# EAGLE design panelmutlimec1lcd (EAGLE 5.06)
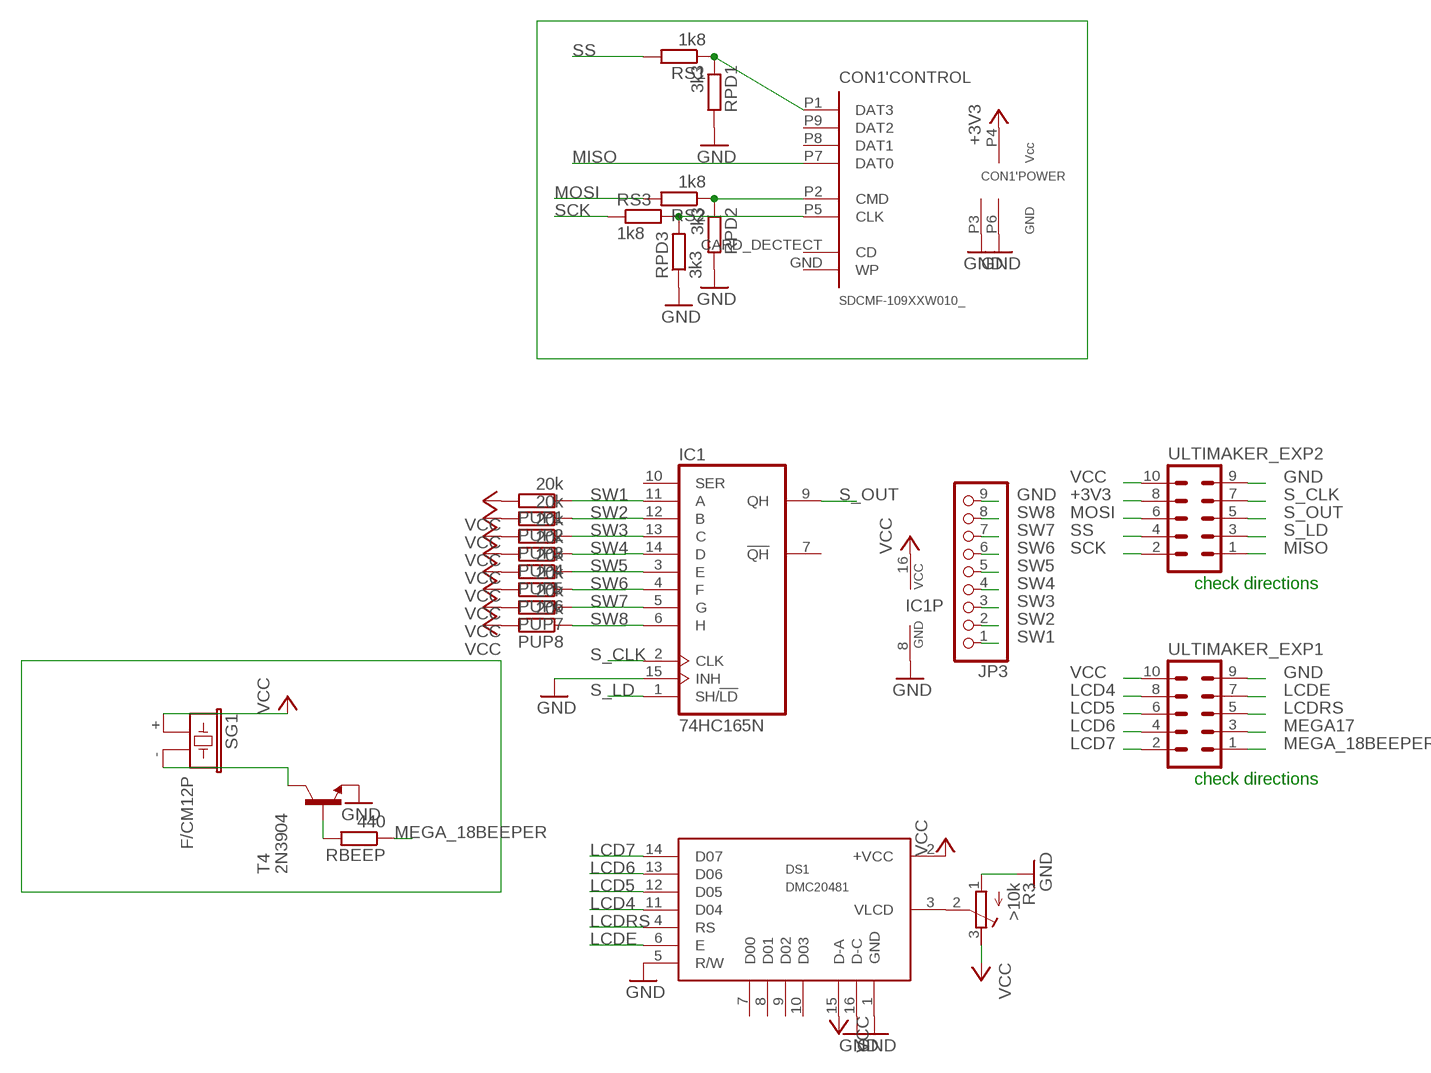
[diagram p0: schematic, sheet 1]

## Parts
CON1  SDCMF-109XXW010_  [HRS163]
DS1  DMC20481  [DM20481]
IC1  74HC165N  [DIL16]
JP3  PINHD-1X9  [1X09]
PUP1  20k  R-EU_R0805  [R0805]
PUP2  20k  R-EU_R0805  [R0805]
PUP3  20k  R-EU_R0805  [R0805]
PUP4  20k  R-EU_R0805  [R0805]
PUP5  20k  R-EU_R0805  [R0805]
PUP6  20k  R-EU_R0805  [R0805]
PUP7  20k  R-EU_R0805  [R0805]
PUP8  20k  R-EU_R0805  [R0805]
R3  >10k  R-TRIMM5X  [RTRIM5X]
RBEEP  440  R-EU_0207/10  [0207/10]
RPD1  3k3  R-EU_0207/12  [0207/12]
RPD2  3k3  R-EU_0207/12  [0207/12]
RPD3  3k3  R-EU_0207/12  [0207/12]
RS1  1k8  R-EU_0207/10  [0207/10]
RS2  1k8  R-EU_0207/10  [0207/10]
RS3  1k8  R-EU_0207/10  [0207/10]
SG1  F/CM12P  [F/CM12P]
T4  2N3904  [TO92]
ULTIMAKER_EXP1  ML10L  [ML10L]
ULTIMAKER_EXP2  ML10L  [ML10L]

## Nets
+3V3: CON1.P4('POWER:VCC) ULTIMAKER_EXP2.8
GND: CON1.P3('POWER:GND) CON1.P6('POWER:GND) DS1.1(GND) DS1.5(R/W) DS1.16(D-C) IC1.8(GND) IC1.15(INH) JP3.9 R3.1(E) RPD1.2 RPD2.2 RPD3.1 T4.3(E) ULTIMAKER_EXP1.9 ULTIMAKER_EXP2.9
LCD4: DS1.11(D04) ULTIMAKER_EXP1.8
LCD5: DS1.12(D05) ULTIMAKER_EXP1.6
LCD6: DS1.13(D06) ULTIMAKER_EXP1.4
LCD7: DS1.14(D07) ULTIMAKER_EXP1.2
LCDE: DS1.6(E) ULTIMAKER_EXP1.7
LCDRS: DS1.4(RS) ULTIMAKER_EXP1.5
MEGA17: ULTIMAKER_EXP1.3
MEGA_18BEEPER: RBEEP.1 ULTIMAKER_EXP1.1
MISO: CON1.P7('CONTROL:DAT0) ULTIMAKER_EXP2.1
MOSI: RS2.2 ULTIMAKER_EXP2.6
N$1: DS1.3(VLCD) R3.2(S)
N$4: RBEEP.2 T4.2(B)
N$7: SG1.- T4.1(C)
N$9: CON1.P5('CONTROL:CLK) RPD3.2 RS3.2
N$13: CON1.P2('CONTROL:CMD) RPD2.1 RS2.1
N$14: CON1.P1('CONTROL:DAT3) RPD1.1 RS1.1
S_CLK: IC1.2(CLK) ULTIMAKER_EXP2.7
S_LD: IC1.1(SH/!LD) ULTIMAKER_EXP2.3
S_OUT: IC1.9(QH) ULTIMAKER_EXP2.5
SCK: RS3.1 ULTIMAKER_EXP2.2
SS: RS1.2 ULTIMAKER_EXP2.4
SW1: IC1.11(A) JP3.1 PUP1.1
SW2: IC1.12(B) JP3.2 PUP2.1
SW3: IC1.13(C) JP3.3 PUP3.1
SW4: IC1.14(D) JP3.4 PUP4.1
SW5: IC1.3(E) JP3.5 PUP5.1
SW6: IC1.4(F) JP3.6 PUP6.1
SW7: IC1.5(G) JP3.7 PUP7.1
SW8: IC1.6(H) JP3.8 PUP8.1
VCC: DS1.2(+VCC) DS1.15(D-A) IC1.16(VCC) PUP1.2 PUP2.2 PUP3.2 PUP4.2 PUP5.2 PUP6.2 PUP7.2 PUP8.2 R3.3(A) SG1.+ ULTIMAKER_EXP1.10 ULTIMAKER_EXP2.10
Unconnected: CON1.CARD_DECTECT('CONTROL:CD) CON1.GND('CONTROL:WP) CON1.P8('CONTROL:DAT1) CON1.P9('CONTROL:DAT2) DS1.7(D00) DS1.8(D01) DS1.9(D02) DS1.10(D03) IC1.7(!QH) IC1.10(SER)

## Notes on the sheet
- check directions
- check directions

## Library data of the parts
CON1 = card_adapters:SDCMF-109XXW010_*: KingFont SD-CARD SDCMF-109XXW010 SD-MODE
DS1 = abi-lcd:DMC20481
IC1 = 74xx-eu:74*165: 8-bit parallel load SHIFT REGISTER
JP3 = pinhead:PINHD-1X9: PIN HEADER
PUP1-PUP8 RBEEP = resistor:R-EU_: RESISTOR, European symbol
R3 = rcl:R-TRIMM: Trimm resistor
RPD1-RPD3 RS1-RS3 = rcl:R-EU_: RESISTOR, European symbol
SG1 = buzzer:F/CM12P: BUZZER Source: Buerklin
T4 = transistor:2N3904: NPN TRANSISTOR
ULTIMAKER_EXP1 ULTIMAKER_EXP2 = con-harting-ml:ML10: HARTING

## Net classes
0 default: width 0.305 mm, drill 0.051 mm, clearance 0.051 mm

## Board
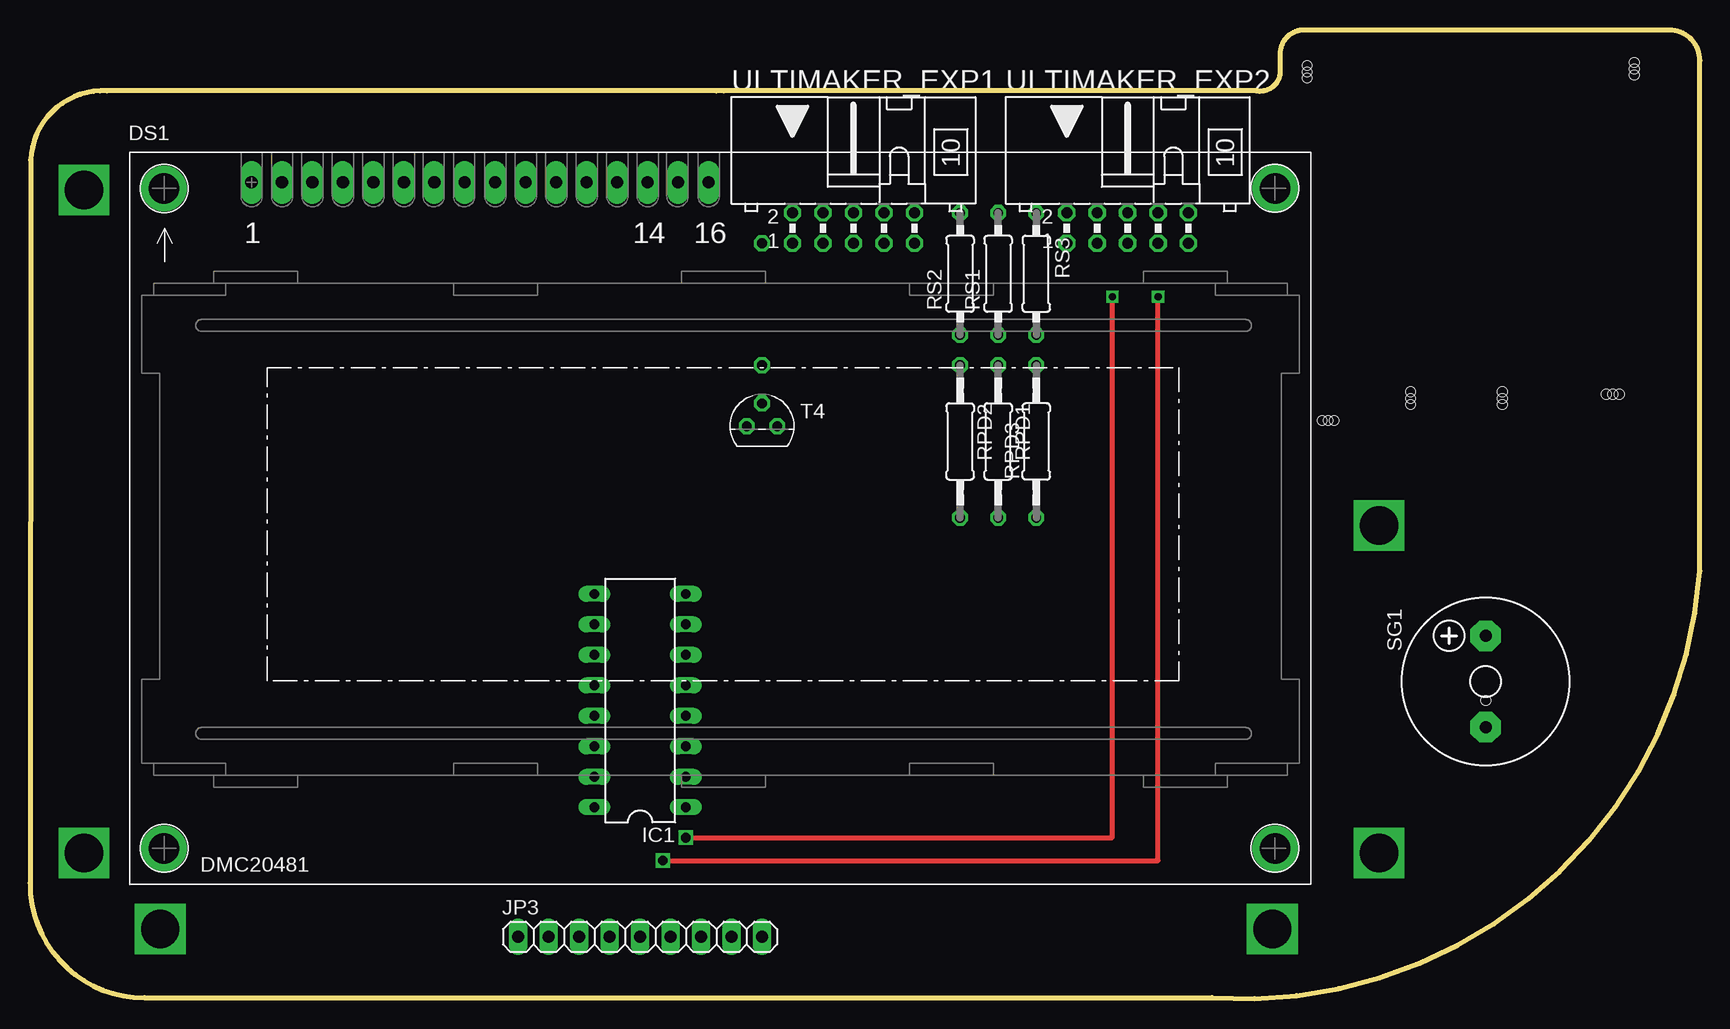
[diagram p1: board, top side]
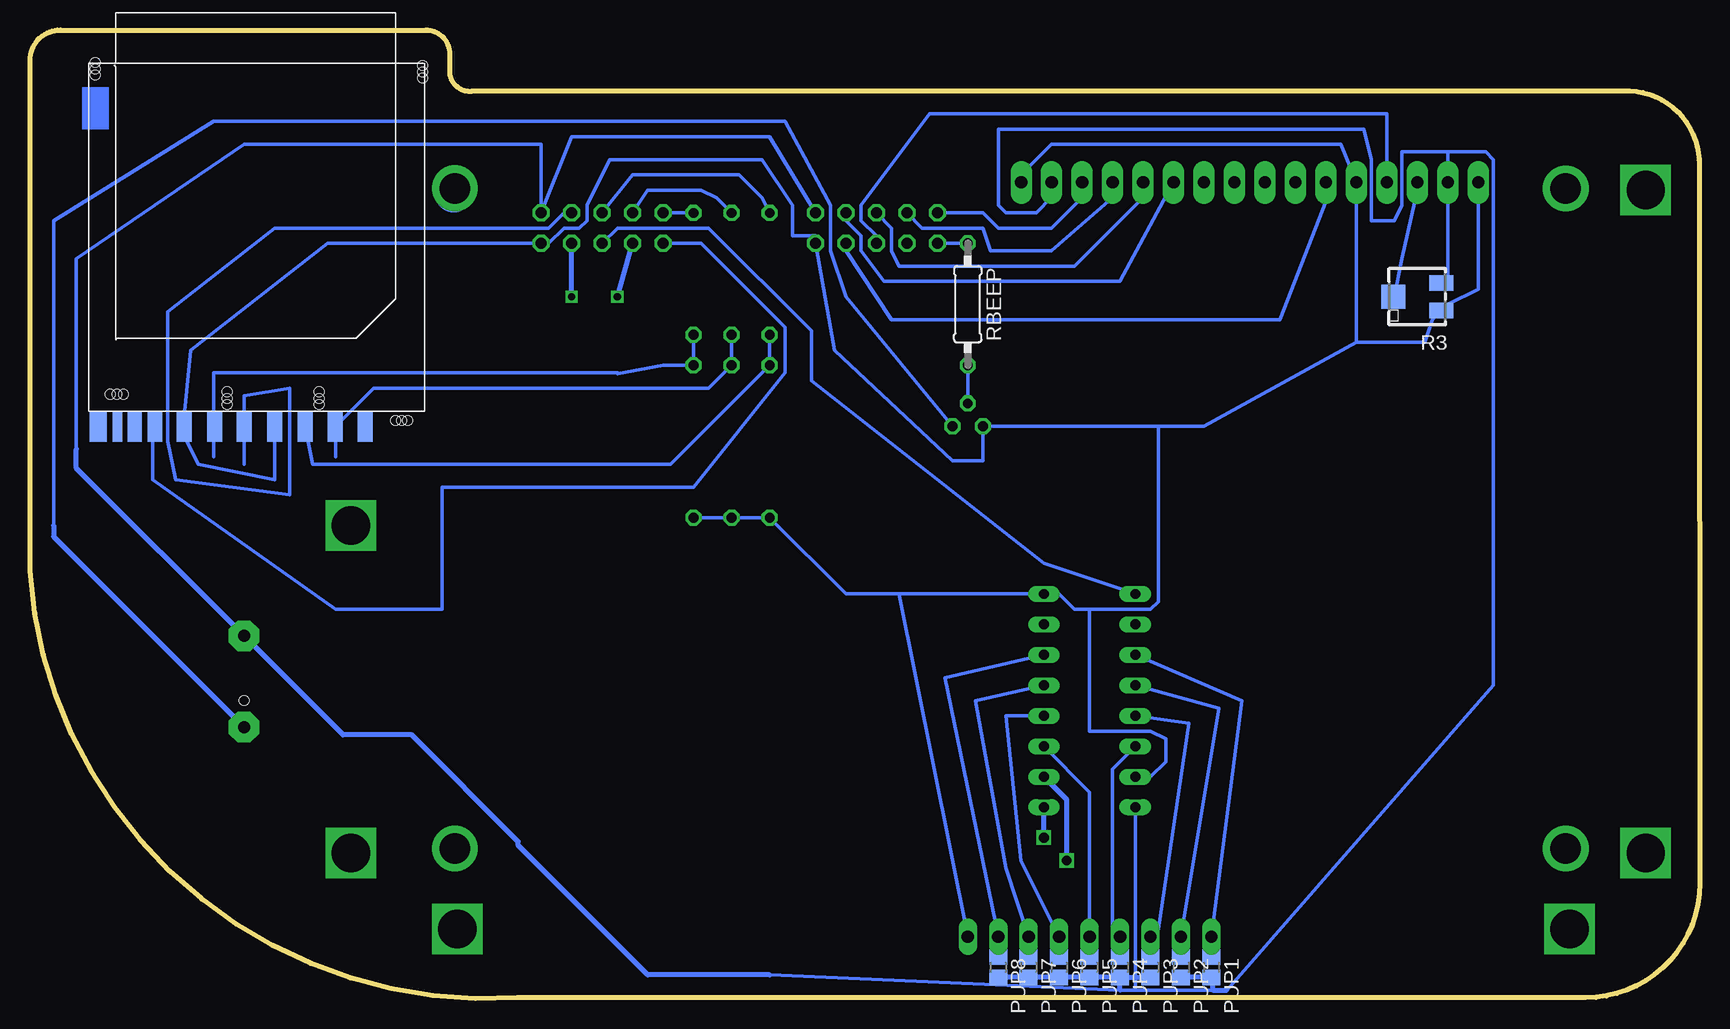
[diagram p2: board, bottom side, seen from below]

Size 139.19 x 80.72 mm. Coordinates in mm from the lower left corner, seen from the top.
Outline: 139.19,78.18 arc90 136.65,80.72 106.2,80.72 arc90 104.2,78.72 104.2,77 arc-90 102.2,75.64 57.84,75.64 57.21,75.64 6.41,75.64 arc90 0.06,69.9 0,9.62 arc90 9.53,0.07 98.55,0.07 arc90 139.19,35.63 139.19,78.18
Copper layers (1*16): Top 0.035mm / dielectric 1.5mm / Bottom 0.035mm
Design rules "default *": minimum track width 10mil, minimum drill 24mil, track to track 8mil, track to pad 8mil, pad to pad 8mil, via to via 8mil, smd to smd 8mil, copper to edge 40mil, drill to drill 8mil, minimum pad ring 10mil, minimum via ring 8mil, stop-mask expansion 4mil, vias tented up to drill 0mil, thermal gap 10mil
Holes 0.8 mm at 121.34,24.84

### Footprints (pad centres in the part's own frame; a part is rotated, then mirrored left to right if it is on the bottom)
HRS163 = smd 0.8 x 2.54: CARD_DECTECT 11.2,1.3 | smd 1.4 x 2.54: GND 12.8,1.3 | smd 1.25 x 2.54: P1 -6.97,1.3; P2 -4.47,1.3; P3 -1.9,1.3; P4 0.625,1.3; P5 3.1,1.3; P6 5.625,1.3; P9 -9.47,1.3 | smd 1.2 x 2.54: P7 8.05,1.3; P8 9.75,1.3 | hole 0.8: -13,0.8; -12,0.8; -12.5,0.8; -5.62,-1.05; 2.03,-1.05; 11.23,-1.4; -14.25,-28.25; 13.03,-28.5; -5.62,-0.55; -5.62,-1.6; 2.03,-1.6; 2.03,-0.55; 11.78,-1.4; 10.68,-1.4; -14.25,-27.75; -14.25,-28.8; 13.03,-28; 13.03,-29.05
DM20481 = drill 1.016 pad 1.778 long: 1 -39.383,29.21; 2 -36.843,29.21; 3 -34.303,29.21; 4 -31.763,29.21; 5 -29.223,29.21; 6 -26.683,29.21; 7 -24.143,29.21; 8 -21.603,29.21; 9 -19.063,29.21; 10 -16.523,29.21; 11 -13.983,29.21; 12 -11.443,29.21; 13 -8.903,29.21; 14 -6.363,29.21; 15 -3.823,29.21; 16 -1.283,29.21 | drill 2.54 pad 3.81 round: P$1 -46.672,-26.289; P$2 45.936,-26.289; P$3 45.936,28.715; P$4 -46.672,28.702
DIL16 = drill 0.813 long: 1 -8.89,-3.81; 2 -6.35,-3.81; 3 -3.81,-3.81; 4 -1.27,-3.81; 5 1.27,-3.81; 6 3.81,-3.81; 7 6.35,-3.81; 8 8.89,-3.81; 9 8.89,3.81; 10 6.35,3.81; 11 3.81,3.81; 12 1.27,3.81; 13 -1.27,3.81; 14 -3.81,3.81; 15 -6.35,3.81; 16 -8.89,3.81
1X09 = drill 1.016 long: 1 -10.16,0; 2 -7.62,0; 3 -5.08,0; 4 -2.54,0; 5 0,0; 6 2.54,0; 7 5.08,0; 8 7.62,0; 9 10.16,0
R0805 = smd 1.3 x 1.5: 1 -0.85,0; 2 0.85,0
RTRIM5X = smd 1.3 x 2: 1 -1.15,-2; 3 1.15,-2 | smd 2 x 2: 2 0,2
0207/10 = drill 0.813 octagon: 1 -5.08,0; 2 5.08,0
0207/12 = drill 0.813 octagon: 1 -6.35,0; 2 6.35,0
F/CM12P = drill 1.016 pad 2.54 octagon: + 3.81,0; - -3.81,0
TO92 = drill 0.813 octagon: 1 1.27,0; 2 0,1.905; 3 -1.27,0
ML10L = drill 0.914 octagon: 1 -5.08,-1.27; 2 -5.08,1.27; 3 -2.54,-1.27; 4 -2.54,1.27; 5 0,-1.27; 6 0,1.27; 7 2.54,-1.27; 8 2.54,1.27; 9 5.08,-1.27; 10 5.08,1.27

### Placement (x,y rotation side)
CON1  120.71,48.97 180 bottom
DS1  57.84,38.81 0 top
IC1  50.86,24.84 90 top
JP3  50.86,5.15 0 top
PUP1  40.7,2.61 270 bottom
PUP2  43.24,2.61 270 bottom
PUP3  45.78,2.61 270 bottom
PUP4  48.32,2.61 270 bottom
PUP5  50.86,2.61 270 bottom
PUP6  53.4,2.61 270 bottom
PUP7  55.94,2.61 270 bottom
PUP8  58.48,2.61 270 bottom
R3  23.55,58.49 90 bottom
RBEEP  61.02,57.86 270 bottom
RPD1  80.7,46.43 270 top
RPD2  77.53,46.43 270 top
RPD3  83.88,46.43 90 top
RS1  80.7,60.4 90 top
RS2  77.53,60.4 90 top
RS3  83.88,60.4 270 top
SG1  121.34,26.42 90 top
T4  61.02,47.7 0 top
ULTIMAKER_EXP1  68.64,64.21 0 top
ULTIMAKER_EXP2  91.5,64.21 0 top

### Tracks (layer width: path | path; a pad name or v marks a point on that pad's centre or on a via)
+3V3
  Bottom 0.305: 121.34,47.7 121.34,50.24 117.53,50.87 117.53,48.97 117.53,46.43 117.53,41.98 127.06,43.25 127.69,46.43 127.69,57.22 118.8,64.21 95.94,64.21 94.67,65.48 ULTIMAKER_EXP2.8 | 121.34,47.7 CON1.P4 | 121.34,47.7 121.34,44.52
GND
  Bottom 0.305: 66.73,33.73 71.18,33.73 RPD2.2 RPD1.2 RPD3.1 | 66.73,33.73 IC1.8 53.4,33.73 52.13,32.46 50.86,32.46 | 66.73,33.73 JP3.9 | DS1.1 18.47,68.02 18.47,59.13 21.01,57.86 R3.1 21.65,57.22 22.28,56.59 22.92,54.68 28.63,54.68 | 28.63,54.68 28.63,68.02 | 28.63,68.02 DS1.5 28.63,68.02 | 28.63,68.02 29.9,71.19 54.03,71.19 55.94,69.29 56.57,68.02 DS1.16 | 45.14,47.7 41.33,47.7 28.63,54.68 | 45.14,47.7 T4.3 59.75,44.84 62.29,44.84 72.13,54.05 ULTIMAKER_EXP1.9 73.72,63.57 75.62,63.57 75.62,66.11 78.16,69.92 90.86,69.92 92.77,66.11 92.77,64.84 93.4,64.21 94.67,64.21 95.94,62.94 ULTIMAKER_EXP2.9 114.36,62.94 125.79,54.05 126.42,47.7 CON1.P6 126.42,47.06 125.15,44.52 118.8,43.25 118.8,47.06 CON1.P3 | 50.86,32.46 45.78,32.46 45.14,33.09 45.14,47.7 | IC1.15 45.78,18.49 44.51,19.76 44.51,21.66 45.78,22.3 48.95,22.3 50.86,22.3 50.86,32.46
LCD4
  Bottom 0.305: ULTIMAKER_EXP1.8 71.18,64.84 69.91,63.57 69.91,62.3 68,59.76 48.32,59.76 43.87,68.02 DS1.11
LCD5
  Bottom 0.305: ULTIMAKER_EXP1.6 67.37,64.21 67.37,62.3 66.73,61.03 52.13,61.03 46.41,66.75 DS1.12
LCD6
  Bottom 0.305: ULTIMAKER_EXP1.4 64.83,64.21 59.75,64.21 59.11,62.3 54.03,62.3 48.95,66.75 DS1.13
LCD7
  Bottom 0.305: ULTIMAKER_EXP1.2 59.75,65.48 58.48,64.21 54.03,64.21 51.49,66.75 DS1.14
LCDE
  Bottom 0.305: ULTIMAKER_EXP1.7 71.18,62.3 67.37,56.59 34.98,56.59 30.54,68.02 DS1.6
LCDRS
  Bottom 0.305: ULTIMAKER_EXP1.5 68.64,63.57 69.91,64.84 69.91,66.11 64.19,73.73 26.09,73.73 26.09,68.02 DS1.4
MEGA_18BEEPER
  Bottom 0.305: RBEEP.1 ULTIMAKER_EXP1.1
MISO
  Bottom 0.305: ULTIMAKER_EXP2.1 83.24,62.94 76.26,55.95 76.26,52.14 83.88,42.62 104.83,42.62 104.83,32.46 113.72,32.46 128.96,43.25 128.96,45.79 128.96,46.43 CON1.P7
MOSI
  Bottom 0.305: RS2.2 78.16,66.75 80.07,68.65 88.96,68.65 ULTIMAKER_EXP2.6
N$1
  Bottom 0.305: R3.2 25.46,58.49 24.82,61.67 23.55,67.38 DS1.3
N$2  (via drill 3.2)
  other vias: 10.85,5.79
N$3  (via drill 3.2)
  other vias: 4.5,12.14
N$4
  Bottom 0.305: T4.2 RBEEP.2
N$5  (via drill 3.2)
  other vias: 4.5,67.38
N$6  (via drill 3.2)
  other vias: 112.45,39.44
N$7
  Bottom 0.305: T4.1 71.18,58.49 72.45,62.3 72.45,66.11 76.26,73.1 123.88,73.1 137.22,64.84 137.22,39.44
  Bottom 0.406: 137.22,39.44 137.22,38.49 SG1.-
N$8  (via drill 3.2)
  other vias: 112.45,12.14
N$9
  Bottom 0.305: RS3.2 RPD3.2 86.42,52.78 90.22,52.09 90.23,52.14 123.88,52.14 123.88,51.51 123.88,48.97 123.88,48.33 123.88,47.7 | 123.88,47.7 CON1.P5 | 123.88,47.7 123.88,45.16
N$10  (via drill 3.2)
  other vias: 103.56,5.79
N$13
  Bottom 0.305: RS2.1 RPD2.1 85.78,44.52 115.63,44.52 CON1.P2
N$14
  Bottom 0.305: RS1.1 RPD1.1 82.61,50.87 110.55,50.87 113.72,47.7 | 113.72,47.7 CON1.P1 | 113.72,47.7 113.72,45.16
S_CLK  (via drill 0.6, 0.8)
  Top 0.406: v52.76,11.5 94.04,11.5 v94.04,58.49
  Bottom 0.406: IC1.2 52.76,16.58 v52.76,11.5 | v94.04,58.49 ULTIMAKER_EXP2.7
S_LD  (via drill 0.6, 0.8)
  Top 0.406: v54.67,13.41 90.23,13.41 v90.23,58.49
  Bottom 0.406: v54.67,13.41 IC1.1 | v90.23,58.49 ULTIMAKER_EXP2.3
S_OUT
  Bottom 0.305: IC1.9 54.67,36.27 74.04,51.51 74.04,55.63 82.61,64.21 90.23,64.21 ULTIMAKER_EXP2.5
SCK
  Bottom 0.305: RS3.1 ULTIMAKER_EXP2.2
SS
  Bottom 0.305: RS1.2 81.97,66.75 83.24,67.38 87.69,67.38 ULTIMAKER_EXP2.4
SW1
  Bottom 0.305: IC1.11 38.16,24.84 JP3.1
  Bottom 0.406: PUP1.1 JP3.1
SW2
  Bottom 0.305: IC1.12 40.06,24.2 JP3.2
  Bottom 0.406: PUP2.1 JP3.2
SW3
  Bottom 0.305: IC1.13 42.6,22.93 45.14,5.79 JP3.3
  Bottom 0.406: PUP3.1 JP3.3
SW4
  Bottom 0.305: IC1.14 48.95,19.12 48.95,5.79 JP3.4
  Bottom 0.406: PUP4.1 JP3.4
SW5
  Bottom 0.305: IC1.3 50.86,17.22 JP3.5
  Bottom 0.406: PUP5.1 JP3.5
SW6
  Bottom 0.305: IC1.4 57.84,23.57 56.57,11.5 JP3.6
  Bottom 0.406: PUP6.1 JP3.6
SW7
  Bottom 0.305: IC1.5 60.38,24.84 57.84,10.87 JP3.7
  Bottom 0.406: PUP7.1 JP3.7
SW8
  Bottom 0.305: IC1.6 62.92,26.74 JP3.8
  Bottom 0.406: PUP8.1 JP3.8
VCC
  Bottom 0.305: ULTIMAKER_EXP1.10 77.53,71.83 94.04,71.83 ULTIMAKER_EXP2.10 96.58,71.19 102.93,71.19 121.34,71.19 135.31,61.67 135.31,45.79 | 21.01,68.02 21.01,59.76 R3.3 | 21.01,68.02 DS1.2 | IC1.16 47.05,3.88 47.05,0.71 | 47.05,0.71 48.32,0.71 77.53,1.98 | 21.01,70.56 21.01,68.02 | 21.01,70.56 19.11,70.56 17.84,70.56 17.2,69.92 17.2,54.05 17.2,26.11 39.43,0.71 40.6,0.71 47.05,0.71 | 21.01,68.02 DS1.2 | DS1.15 54.02,66.76 55.3,65.48 57.84,65.48 58.48,66.11 58.48,72.46 28,72.46 27.36,69.92 27.36,64.84 25.46,64.84 24.82,66.11 24.82,70.56 21.01,70.56 | 21.01,70.56 DS1.2
  Bottom 0.406: PUP2.2 PUP1.2 40.6,0.71 39.43,0.71 | PUP4.2 PUP3.2 | PUP4.2 PUP5.2 PUP6.2 PUP7.2 PUP8.2 | 48.32,0.71 PUP4.2 | 135.31,45.79 135.31,44.2 SG1.+ 113.09,21.98 107.37,21.98 98.48,13.09 98.48,12.77 87.69,1.98 77.53,1.98
(copper drawn outside any net)
  shapes: Bottom circle x1